# EAGLE design IR 1E2R (EAGLE 8.6.0)
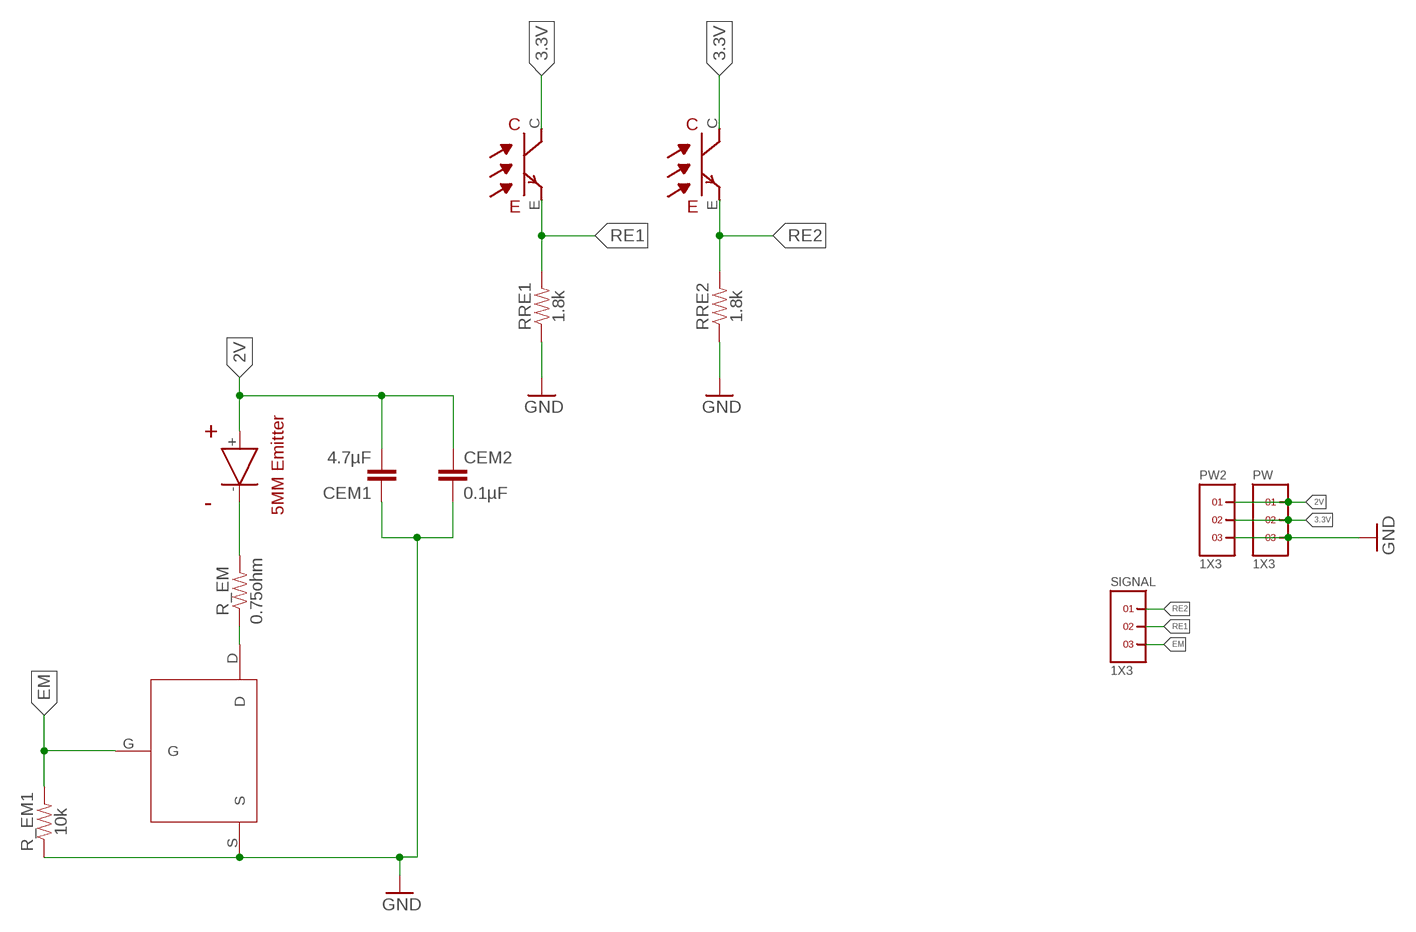
[diagram p0: schematic, sheet 1]

## Parts
CEM1  4.7µF  0.33UF/330NF-0805-50V-10%  [0805]
CEM2  0.1µF  0.33UF/330NF-0805-50V-10%  [0805]
PW  1X3  [1X3]
PW2  1X3  [1X3]
R_EM  0.75ohm  0.75OHM-0805-1/4W-1%  [0805]
R_EM1  10k  0.75OHM-0805-1/4W-1%  [0805]
RECEIVER1  RECEIVER  [RECEIVER]
RECEIVER2  RECEIVER  [RECEIVER]
RRE1  1.8k  0.75OHM-0805-1/4W-1%  [0805]
RRE2  1.8k  0.75OHM-0805-1/4W-1%  [0805]
SIGNAL  1X3  [1X3]
U$1  MCH3474  [MCH3474]
U$21  EMITTER  [EMITTER]

## Nets
2V: CEM1.2 CEM2.1 PW2.1 PW.1 U$21.+
3.3V: PW2.2 PW.2 RECEIVER1.C RECEIVER2.C
EM: R_EM1.2 SIGNAL.3 U$1.G
EM-: R_EM.2 U$21.-
GND: CEM1.1 CEM2.2 PW2.3 PW.3 R_EM1.1 RRE1.1 RRE2.1 U$1.S
N$1: R_EM.1 U$1.D
RE1: RECEIVER1.E RRE1.2 SIGNAL.2
RE2: RECEIVER2.E RRE2.2 SIGNAL.1

## Library data of the parts
CEM1 CEM2 = SparkFun-Capacitors:0.33UF/330NF: 0.33µF/330nF ceramic capacitors A capacitor is a passive two-terminal electrical component used to store electrical energy temporarily in an electric field.; PROD_ID: CAP-08469; VALUE: 0.33µF
PW PW2 SIGNAL = headers(2mm):1X3
R_EM R_EM1 RRE1 RRE2 = SparkFun-Resistors:0.75OHM: 0.75Ω resistor A resistor is a passive two-terminal electrical component that implements electrical resistance as a circuit element. Resistors act to reduce current flow, and, at the same time, act to lower voltage levels within circuits. - Wikipedia; PROD_ID: RES-08474; VALUE: 0.75
RECEIVER1 RECEIVER2 = sfh4550 & teft4300:RECEIVER
U$1 = MCH3474:MCH3474
U$21 = sfh4550 & teft4300:EMITTER

## Board
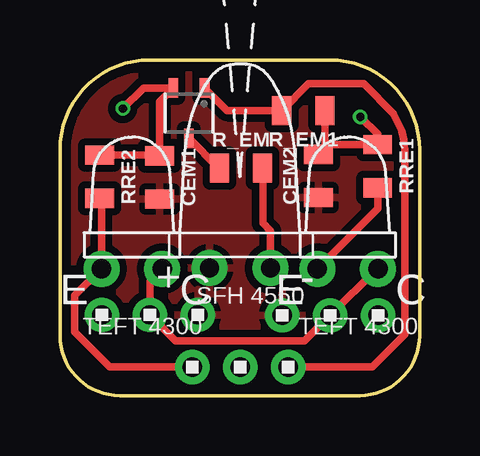
[diagram p1: board, top side]
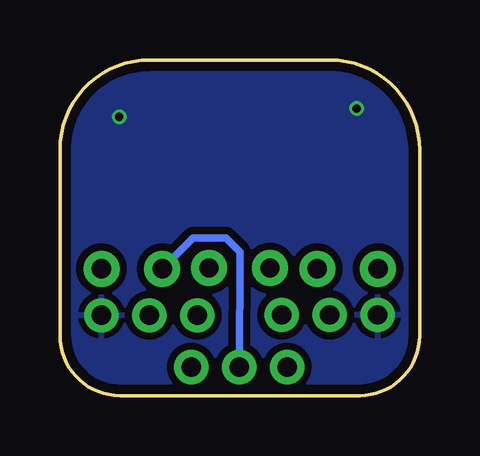
[diagram p2: board, bottom side, seen from below]

Size 15 x 14 mm. Coordinates in mm from the lower left corner, seen from the top.
Outline: 2.5,0 12.5,0 arc90 15,2.5 15,10.25 arc90 11.25,14 3.75,14 arc90 0,10.25 0,2.5 arc90 2.5,0
Copper layers (1*16): Top 0.035559375mm / dielectric 1.6mm / Bottom 0.035559375mm
Design rules "oshpark-2layer *": minimum track width 6mil, minimum drill 10mil, track to track 6mil, track to pad 6mil, pad to pad 6mil, via to via 6mil, smd to smd 6mil, copper to edge 15mil, drill to drill 6mil, minimum pad ring 5mil, minimum via ring 5mil, stop-mask expansion 0mil, vias tented up to drill 12mil, thermal gap 10mil

### Footprints (pad centres in the part's own frame; a part is rotated, then mirrored left to right if it is on the bottom)
0805 = smd 0.8 x 1.2: 1 -0.9,0; 2 0.9,0
1X3 = drill 0.8 pad 1.422: 1 -2,0; 2 0,0; 3 2,0
RECEIVER = drill 0.8 pad 1.5: C 1.27,-0.5; E -1.27,-0.5
MCH3474 = smd 0.406 x 0.813: D 0,1.05; G -0.65,-1.05; S 0.65,-1.05
EMITTER = drill 0.8 pad 1.5: + -1.27,-0.5; - 1.27,-0.5

### Placement (x,y rotation side)
CEM1  4.16,9.1 270 top
CEM2  10.78,9.16 90 top
PW  11.27,3.35 0 top
PW2  3.75,3.36 180 top
R_EM  7.55,9.49 0 top
R_EM1  10.15,11.89 180 top
RECEIVER1  12,5.79 0 top
RECEIVER2  3,5.79 0 top
RRE1  13.25,9.57 270 top
RRE2  1.65,9.13 270 top
SIGNAL  7.52,1.19 0 top
U$1  5.38,11.78 180 top
U$21  7.51,5.82 0 top

### Tracks (layer width: path | path; a pad name or v marks a point on that pad's centre or on a via)
2V
  pour Top (isolate 0.305): -7,18.5 -7,-3.25 -5.5,-4.75 20,-4.75 21.5,-3.25 21.5,16 19.25,18.25 17,20.5 -4.25,20.5 -5,20.5
3.3V
  Top 0.305: RECEIVER2.C 3.75,4.77 PW2.2 4.83,2.28 10.2,2.28 PW.2 13.21,5.29 RECEIVER1.C
EM
  Top 0.305: SIGNAL.3 13.03,1.19 14.39,2.55 14.39,10.25 14.35,10.66 14.26,11.02 13.91,11.77 12.67,13.01 10.37,13.01 R_EM1.2 6.97,11.89 U$1.G
EM-
  Top 0.305: U$21.- 8.78,6.87 8.46,7.19 R_EM.2
GND  (via drill 0.35)
  Top 0.305: R_EM1.1 11.05,10.33 CEM2.2 11.19,10.47 RRE1.1 13.25,10.9 v12.53,11.62 | RRE2.1 4.13,10.03 CEM1.1 4.16,12.26 U$1.S 3.48,12.83 v2.62,11.97
  pour Bottom (isolate 0.305): -3,15 -3,0.25 -1.5,-1.25 17,-1.25 17,15.25 17.25,15.5 -2.5,15.5
N$1
  Top 0.305: U$1.D 6.62,9.49 R_EM.1
RE1
  Top 0.305: RECEIVER1.E 13.25,7.81 RRE1.2
  Bottom 0.305: SIGNAL.2 7.5,6 8.08,6.58 9.44,6.58 RECEIVER1.E
RE2
  Top 0.305: SIGNAL.1 2.07,1.19 0.61,2.65 0.61,4.17 RECEIVER2.E 1.73,8.15 RRE2.2